# Altium project Comb_Generator.PrjPcb
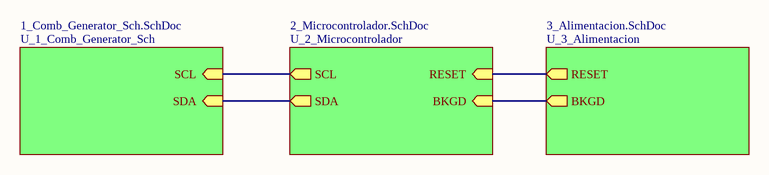
[diagram p0: Esquematico.SchDoc]
4 sheets, 62 parts. Net scope: hierarchical (ports join the sheet entries above them; power ports are global).
Board file: Comb_Generator_PCB.PcbDoc
Sheets:
  Esquematico.SchDoc
    U_1_Comb_Generator_Sch = 1_Comb_Generator_Sch.SchDoc
    U_2_Microcontrolador = 2_Microcontrolador.SchDoc
    U_3_Alimentacion = 3_Alimentacion.SchDoc

## Sheet Esquematico.SchDoc
size A4; SheetNumber: 1; SheetTotal: 4

### Sub-sheets
U_1_Comb_Generator_Sch = 1_Comb_Generator_Sch.SchDoc: SCL (in), SDA (in)
U_2_Microcontrolador = 2_Microcontrolador.SchDoc: RESET (in), BKGD (in), SCL (out), SDA (out)
U_3_Alimentacion = 3_Alimentacion.SchDoc: RESET (out), BKGD (out)

### Nets
BKGD: sheet U_2_Microcontrolador/BKGD, sheet U_3_Alimentacion/BKGD
RESET: sheet U_2_Microcontrolador/RESET, sheet U_3_Alimentacion/RESET
SCL: sheet U_1_Comb_Generator_Sch/SCL, sheet U_2_Microcontrolador/SCL
SDA: sheet U_1_Comb_Generator_Sch/SDA, sheet U_2_Microcontrolador/SDA

## Sheet 1_Comb_Generator_Sch.SchDoc
size A4; SheetNumber: 2; SheetTotal: 4; SPICEModelCacheYMJCRCOB: <root> / <DocumentId>YMJCRCOB</DocumentId> / </root>
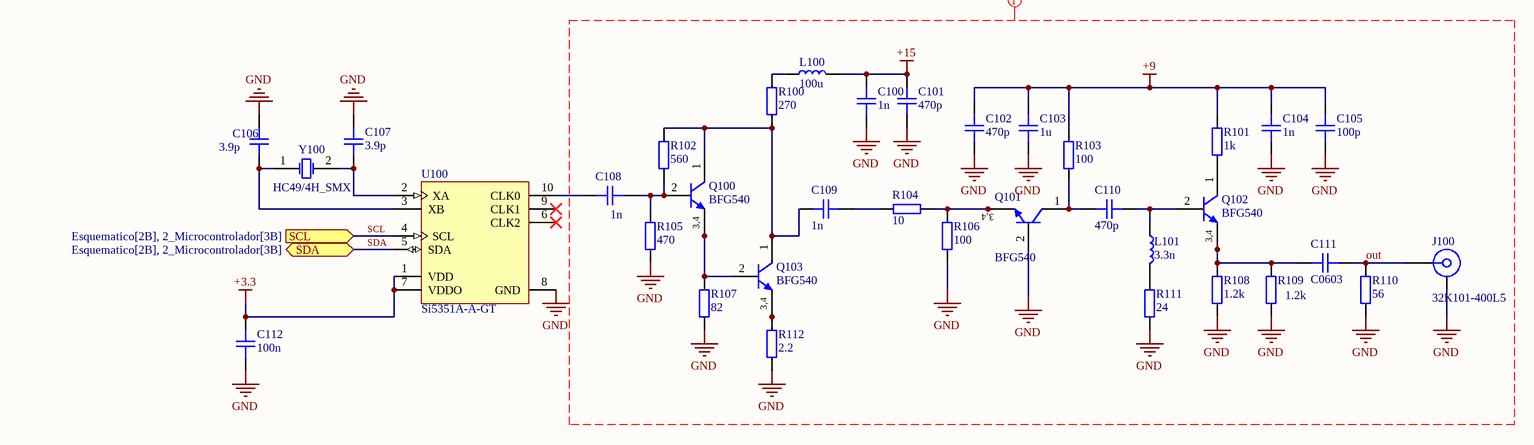
[diagram p1: 1_Comb_Generator_Sch.SchDoc]

### Parts
C100  1n  [CAP_0603]
C101  470p  [CAP_0603]
C102  470p  [CAP_0603]
C103  1u  [CAP_0603]
C104  1n  [CAP_0603]
C105  100p  [CAP_0603]
C106  3.9p  [CAP_0603]
C107  3.9p  [CAP_0603]
C108  1n  [CAP_0603]
C109  1n  [CAP_0603]
C110  470p  [CAP_0603]
C111  C0603  [CAP_0603]
C112  100n  [CAP_0603]
J100  32K101-400L5  [ROS-32K101-400L5_V]
L100  100u  [IND_0603]
L101  3.3n  [IND_0603]
Q100  BFG540  [SOT143B_N]
Q101  BFG540  [SOT143B_N]
Q102  BFG540  [SOT143B_N]
Q103  BFG540  [SOT143B_N]
R100  270  [RES_0603]
R101  1k  [RES_0603]
R102  560  [RES_0603]
R103  100  [RES_0603]
R104  10  [RES_0603]
R105  470  [RES_0603]
R106  100  [RES_0603]
R107  82  [RES_0603]
R108  1.2k  [RES_0603]
R109  1.2k  [RES_0603]
R110  56  [RES_0603]
R111  24  [RES_0603]
R112  2.2  [RES_0603]
U100  Si5351A-A-GT  [SLAB-MSOP-10_N]
Y100  HC49/4H_SMX  [HC49/4H_SMX]

### Ports
SCL (in, see Esquematico[2B], 2_Microcontrolador[3B]), SDA (bidir, see Esquematico[2B], 2_Microcontrolador[3B])

### Nets
+3.3: C112.1 U100.1(VDD) U100.7(VDDO)
+9: C102.1 C103.1 C104.1 C105.1 R101.2 R103.2
+15: C100.1 C101.1 L100.1
GND: C100.2 C101.2 C102.2 C103.2 C104.2 C105.2 C106.2 C107.2 C112.2 J100.MH Q101.2(B) R105.1 R106.1 R107.1 R108.1 R109.1 R110.1 R111.1 R112.1 U100.8(GND)
out: C111.2 J100.1 R110.2
SCL: U100.4(SCL) ; port SCL
SDA: U100.5(SDA) ; port SDA
NetC106_1: C106.1 U100.3(XB) Y100.1(OSC1)
NetC107_1: C107.1 U100.2(XA) Y100.2(OSC2)
NetC108_1: C108.1 Q100.2(B) R102.1 R105.2
NetC108_2: C108.2 U100.10(CLK0)
NetC109_1: C109.1 Q100.1(C) Q103.1(C) R100.1 R102.2
NetC109_2: C109.2 R104.2
NetC110_1: C110.1 L101.1 Q102.2(B)
NetC110_2: C110.2 Q101.1(C) R103.1
NetC111_1: C111.1 Q102.3(E) Q102.4(E) R108.2 R109.2
NetL100_2: L100.2 R100.2
NetL101_2: L101.2 R111.2
NetQ100_3: Q100.3(E) Q100.4(E) Q103.2(B) R107.2
NetQ101_3: Q101.3(E) Q101.4(E) R104.1 R106.2
NetQ102_1: Q102.1(C) R101.1
NetQ103_3: Q103.3(E) Q103.4(E) R112.2

Not connected (* = marked no-connect by the designer): U100 6(CLK2)* 9(CLK1)*

### Layout directives
net class RF_IMPEDANCE: +9, +15, GND, out

### Notes on the sheet
- (in symbol BFG540) 3,4

### Library data of the parts
C100-C112 = CAP_0603: Capacitor SMD 0603; Manufacturer: *; Manufacturer Part Number: *; Distributor Link: *; LCSC: *; Rating: *; Dielectric: *
J100 = CMP-0751-00001-1: SMA Straight Jack, Up to 18 GHz, -55 to 155 degC; Manufacturer: Rosenberger; Design Note: Footprint in library is a generic example - only application specific footprint delivers High Performance; PartNumber: 32K101-400L5; PackageDescription: SMA Straight Jack, 6.35 x 6.35 x 9.5 mm; ComponentLink5URL: http://www.rosenberger.com/en/contact/sales/; DatasheetVersion: a00; ComponentLink3URL: http://rosenberger.de/ok/images/documents/db/32K101-400L5.pdf; ComponentLink4Description: Series Overview / Design Note; ComponentLink5Description: Webshop / RFQ; PackageReference: 32K101-400L5; ComponentLink2Description: Datasheet; PackageVersion: a00; ComponentLink1Description: Manufacturer URL; ComponentLink3Description: Package Specification; ComponentLink2URL: http://rosenberger.de/ok/images/documents/db/32K101-400L5.pdf; Mounting Technology: Through Hole; ComponentLink1URL: http://www.rosenberger.de; ComponentLink4URL: http://rosenberger.de/ok/images/documents/spez/32.pdf
L100 L101 = IND_0603: Inductor SMD 0603
Q100-Q103 = BFG540: NPN 9 GHz Wideband Transistor; Published: 17-Sep-2003; LatestRevisionDate: 12-Dec-2006; LatestRevisionNote: IPC-7351 Footprint Added.; DatasheetVersion: 23-May-2000; PackageVersion: Oct-2001; PackageReference: SOT143B; Publisher: Altium Limited; PackageDescription: 4-Pin SOT-143 Package 1.9 mm Pitch, 2.3 mm Lead Span; ComponentLink1Description: Manufacturer Link; ComponentLink1URL: http://www.semiconductors.philips.com/; ComponentLink2Description: Datasheet; ComponentLink2URL: http://www.semiconductors.philips.com/acrobat/datasheets/BFG540_X_XR_4.pdf
R100-R112 = RES_0603: Resistor SMD 0603; Manufacturer: *; Manufacturer Part Number: *; Distributor Link: *; LCSC: *
U100 = Si5351A-A-GT: I2C-Programmable Any-Frequency CMOS Clock Generator + VCXO, 2.5 / 3.3 V, 0.008 to 160 MHz Output, -40 to 85 degC, 10-pin SOP; Manufacturer: Silicon Labs; Output Format: LVCMOS; Reference Inputs: 1; VDD: 2.5 V; 3.3 V; Sub-Family: Clock Generators; DatasheetVersion: Rev. 0.95; PackageReference: MSOP-10; PackageDescription: 10-Pin Mini Small Outline Package, Body 3 x 3 mm, Pitch 0.5 mm; Supplier 1: Digi-Key; Supplier Part Number 1: 336-1994-5-ND; Supplier 2: Mouser; Supplier Part Number 2: 634-SI5351A-A-GT; Output Frequency (MHz): 0.008 to 160; Mounting Technology: Surface Mount; Code_JEDEC: MO-187; Code_IPC: J-STD-020; PartNumber: Si5351A-A-GT; ComponentLink1Description: Manufacturer URL; ComponentLink1URL: http://www.silabs.com/; ComponentLink2Description: Datasheet; ComponentLink2URL: http://www.silabs.com/Support%20Documents/TechnicalDocs/Si5351.pdf; ComponentLink3Description: Package Specification; ComponentLink3URL: http://www.silabs.com/Support Documents/TechnicalDocs/C8051T60x.pdf
Y100 = HC49/4H_SMX: Surface Mount Quartz Crystal; Note: PCB layout complies with manufacturer's recommendation.; Published: 17-Jul-2002; DatasheetDocument: 18-Oct-1999; PackageDocument: 18-Oct-1999; PackageReference: HC49/4H_SMX; Publisher: Altium Limited; ComponentLink1Description: Manufacturer Link; ComponentLink1URL: http://www.cmac.com/mt/; ComponentLink2Description: Datasheet; ComponentLink2URL: http://www.cmac.com/mt/databook/crystals/smd/hc49_4h_smx.pdf

## Sheet 2_Microcontrolador.SchDoc
size A4; SheetNumber: 3; SheetTotal: 4; SPICEModelCacheOGEEZERP: <root> / <DocumentId>OGEEZERP</DocumentId> / </root>
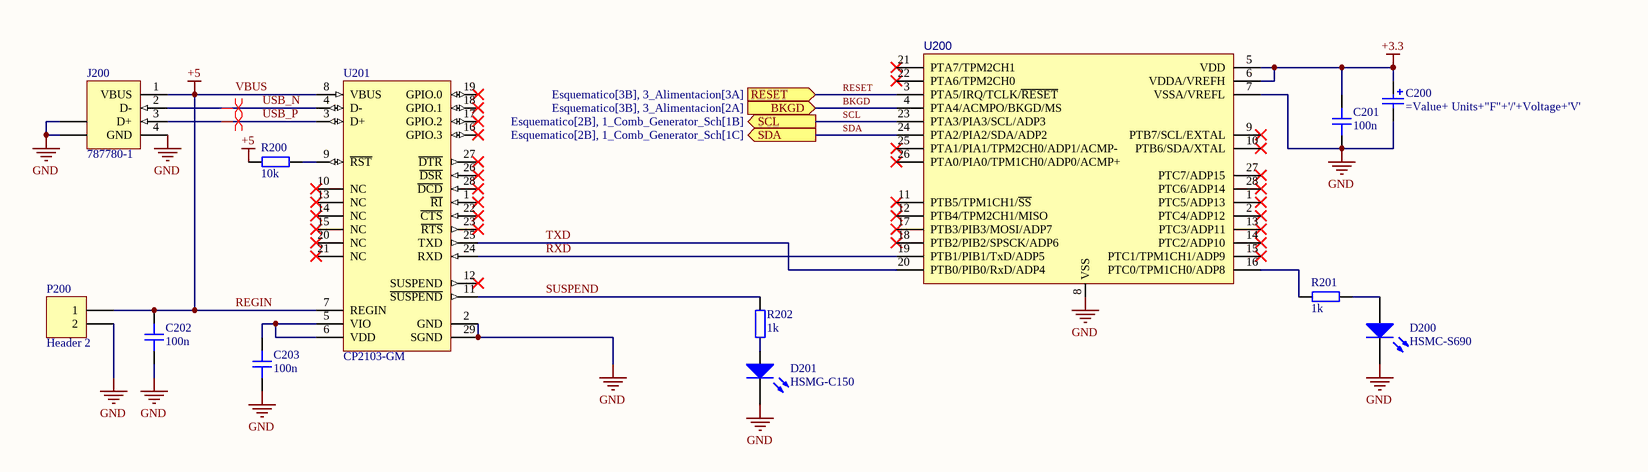
[diagram p2: 2_Microcontrolador.SchDoc]

### Parts
C200  (no value)  [C SIZE SMD CAPACITOR]
C201  100n  [CAP_0603]
C202  100n  [CAP_0603]
C203  100n  [CAP_0603]
D200  HSMC-S690  [1.6X0.8X0.7]
D201  HSMG-C150  [3.2X1.6X1.1]
J200  787780-1  [USB 787780]
P200  Header 2  [HDR1X2]
R200  10k  [RES_0603]
R201  1k  [RES_0603]
R202  1k  [RES_0603]
U200  (no value)  [TSSOP28_25.5_295_15X58_SMD]
U201  CP2103-GM  [SLAB-QFN-28-3125x3125TP_A_N]

### Ports
BKGD (in, see Esquematico[3B], 3_Alimentacion[2A]), RESET (in, see Esquematico[3B], 3_Alimentacion[3A]), SCL (out, see Esquematico[2B], 1_Comb_Generator_Sch[1B]), SDA (out, see Esquematico[2B], 1_Comb_Generator_Sch[1C])

### Nets
+3.3: C200.1 C201.1 U200.5(VDD) U200.6(VDDA/VREFH)
GND: C200.2 C201.2 C202.2 C203.2 D200.2(K) D201.2(K) J200.4(GND) J200.5(SHLD) J200.6(SHLD) P200.2 U200.7(VSSA/VREFL) U200.8(VSS) U201.2(GND) U201.29(SGND)
REGIN: C202.1 J200.1(VBUS) P200.1 R200.2 U201.7(REGIN) U201.8(VBUS)  [also labelled +5, VBUS]
BKGD: U200.4(PTA4/ACMPO/BKGD/MS) ; port BKGD
RESET: U200.3(PTA5/IRQ/TCLK/~{RESET}) ; port RESET
RXD: U200.19(PTB1/PIB1/TxD/ADP5) U201.24(RXD)
SCL: U200.23(PTA3/PIA3/SCL/ADP3) ; port SCL
SDA: U200.24(PTA2/PIA2/SDA/ADP2) ; port SDA
SUSPEND: R202.1 U201.11(~{SUSPEND})
TXD: U200.20(PTB0/PIB0/RxD/ADP4) U201.25(TXD)
USB_N: J200.2(D-) U201.4(D-)
USB_P: J200.3(D+) U201.3(D+)
NetC203_1: C203.1 U201.5(VIO) U201.6(VDD)
NetD200_1: D200.1(A) R201.2
NetD201_1: D201.1(A) R202.2
NetR200_1: R200.1 U201.9(~{RST})
NetR201_1: R201.1 U200.16(PTC0/TPM1CH0/ADP8)

Not connected (* = marked no-connect by the designer): U200 1(PTC5/ADP13)* 2(PTC4/ADP12)* 9(PTB7/SCL/EXTAL)* 10(PTB6/SDA/XTAL)* 11(PTB5/TPM1CH1/~{SS})* 12(PTB4/TPM2CH1/MISO)* 13(PTC3/ADP11)* 14(PTC2/ADP10)* 15(PTC1/TPM1CH1/ADP9)* 17(PTB3/PIB3/MOSI/ADP7)* 18(PTB2/PIB2/SPSCK/ADP6)* 21(PTA7/TPM2CH1)* 22(PTA6/TPM2CH0)* 25(PTA1/PIA1/TPM2CH0/ADP1/ACMP-)* 26(PTA0/PIA0/TPM1CH0/ADP0/ACMP+)* 27(PTC7/ADP15)* 28(PTC6/ADP14)*; U201 1(~{RI})* 10(NC)* 12(SUSPEND)* 13(NC)* 14(NC)* 15(NC)* 16(GPIO.3)* 17(GPIO.2)* 18(GPIO.1)* 19(GPIO.0)* 20(NC)* 21(NC)* 22(~{CTS})* 23(~{RTS})* 26(~{DSR})* 27(~{DTR})* 28(~{DCD})*

### Layout directives
differential pair; differential pair class USB: USB_N, USB_P

### Library data of the parts
C200 = Cap Pol1: Capacitor Electr. Alum. SMD WxLxH 6.3x6.3x5.3 Ǿ= 6 mm; Manufacturer: Generic Components; Class: Passive; Value: 47; PDT: PDT_GA500P+; CRITICO: NO; Voltage: 16; Diam: 6.3; Units: u; ASY_DESCRIPTION: Electrónica Galert 500P+; ASY_CRITICO: S; ELEMON: EH51EM470E05OC; Published: 08/06/2000; Publisher: Altium Hobart Technology Centre; SubClass: Capacitor; GAMMASYS: =C+auto_range + ''+Exponent+Material+Voltage+ PackageReference; ASY: =PS+PCB+'R'+PCB_REV; PackageReference: 0607; Height: 10; auto_range: =(NORM >= 1) * (NORM < 100) * NORM + (NORM >= 1E2) * (NORM < 1E3) * NORM / 10 + (NORM >= 1E3) * (NORM < 1E4) * NORM / 1E2 + (NORM >= 1E4) * (NORM < 1E5) * NORM / 1E3 + (NORM >= 1E5) * (NORM < 1E6) * NORM / 1E4 + (NORM >= 1E6) * (NORM < 1E7) * NORM / 1E5 + (NORM >= 1E7) * (NORM < 1E8) * NORM / 1E6 + (NORM >= 1E8) * (NORM < 1E9) * NORM / 1E7 + (NORM >= 1E9) * (NORM < 1E10) * NORM / 1E8 + (NORM >= 1E10) * (NORM < 1E11) * NORM / 1E9; Exponent: =(NORM >= 1) * (NORM < 1E2) * 0 || (NORM >= 1E2) * (NORM < 1E3) * 1 || (NORM >= 1e3) * (NORM < 1e4) * 2 ||(NORM >= 1E4) * (NORM < 1E5) * 3 || (NORM >= 1E5) * (NORM < 1E6) * 4 || (NORM >= 1E6) * (NORM < 1E7) * 5 || (NORM >= 1E7) * (NORM < 1E8) * 6 || (NORM >= 1E8) * (NORM < 1E9) * 7 || (NORM >= 1E9) * (NORM < 1E10) * 8 || (NORM >= 1E10) * (NORM < 1E11) * 9; NORM: =-(not (Units <> m) * 1E3 + not (Units <> u)*1E0 )*Value
C201-C203 = CAP_0603: Capacitor SMD 0603; Manufacturer: *; Manufacturer Part Number: *; Distributor Link: *; LCSC: *; Rating: *; Dielectric: *
D200 = HSMC-S690: SMT Top Mount Chip LED, Red; LuminousIntensity: 16mcd (Minimum).; PCB_Layout: Complies with manufacturer's recommendation.; Published: 11-Dec-2002; DatasheetDocument: 29-Oct-2001; PackageDocument: 29-Oct-2001; PackageReference: 1.6X0.8X0.7; Publisher: Altium Limited; LED_Colour: Red; ComponentLink1Description: Manufacturer Link; ComponentLink1URL: http://www.agilent.com/; ComponentLink2Description: Datasheet; ComponentLink2URL: http://cp.literature.agilent.com/litweb/pdf/5988-4445EN.pdf
D201 = HSMG-C150: Surface Mount Chip LED, Green; LuminousIntensity: 4mcd (Minimum).; PCB_Layout: Complies with manufacturer's recommendation.; Published: 11-Dec-2002; DatasheetDocument: 30-Apr-2002; PackageDocument: 26-Feb-2002; PackageReference: 3.2X1.6X1.1; Publisher: Altium Limited; LED_Colour: Green; ComponentLink1Description: Manufacturer Link; ComponentLink1URL: http://www.agilent.com/; ComponentLink2Description: Datasheet; ComponentLink2URL: http://cp.literature.agilent.com/litweb/pdf/5988-6271EN.pdf
J200 = 787780-1: USB 1.1, Right Angle, Thru-Hole, B Type, Receptacle, 4 Position, Black; ContactMaterial: Copper Alloy; ContactPlating: Gold Flash over Palladium Nickel or Gold (30) over Nickel; TerminationLength: 3.00mm [0.118in.]; PCB_Layout: Complies with manufacturer's recommendation.; DrillSize: Corresponds to nominal value.; PanelGround: Without; Published: 15-Jul-2004; DatasheetDocument: 11-Jan-2004; PackageDocument: 11-Jan-2004; PackageReference: 787780; Publisher: Altium Limited; HousingMaterial: Thermoplastic; ComponentLink1Description: Manufacturer Link; ComponentLink1URL: http://www.tycoelectronics.com/; ComponentLink2Description: Packaging Specification; ComponentLink2URL: http://ecommas.tycoelectronics.com/commerce/DocumentDelivery/DDEController?Action=showdoc&DocId=Customer+Drawing%7F787780%7FF%7Ftif%7FEnglish%7FENG_CD_787780_F.tif
P200 = Header 2: Header, 2-Pin; LatestRevisionDate: 17-Jul-2002; LatestRevisionNote: Re-released for DXP Platform.; Publisher: Altium Limited
R200-R202 = RES_0603: Resistor SMD 0603; Manufacturer: *; Manufacturer Part Number: *; Distributor Link: *; LCSC: *
U200 = MC9S08SH32CTL: IC MCU 8BIT 32KB FLASH 28TSSOP / WITH AUTO-DIRECTION SENSING AND ±15-kV ESD PROTECTION; Part Number: MC9S08SH32CTL_TSSOP28; Manufacturer: NXP USA Inc.; Publico: AP; Value: MC9S08SH32; Manufacturer Part Number: MC9S08SH32CTL; Supplier 1: Digi-Key; Supplier Part Number 1: MC9S08SH32CTL-ND; Aprobo: -
U201 = CP2103-GM: Single-Chip USB to UART Bridge, 1024 Bytes EEPROM, -40 to 85 degC, 28-pin QFN, Tube; Manufacturer: Silicon Labs; Internal Oscillator: TRUE; Sub-Family: USB Bridges; DatasheetVersion: Rev. 1.0; PackageReference: QFN-28; PackageDescription: 28-Pin Quad-Flat No-Leads Package, Body 5 x 5 mm, Pitch 0.5 mm; Supplier 1: Digi-Key; Supplier Part Number 1: 336-1164-ND; Supplier 2: Farnell; Supplier Part Number 2: 1291538; Supplier 3: Newark; Supplier Part Number 3: 24M1109; Supplier 4: Mouser; Supplier Part Number 4: 634-CP2103-GM; EEPROM: 1024 Bytes; Mounting Technology: Surface Mount; PartNumber: CP2103-GM; ComponentLink1Description: Manufacturer URL; ComponentLink1URL: http://www.silabs.com/; ComponentLink2Description: Datasheet; ComponentLink2URL: http://www.silabs.com/Support%20Documents/TechnicalDocs/CP2103.pdf; ComponentLink3Description: Package Specification; ComponentLink3URL: http://www.silabs.com/Support%20Documents/TechnicalDocs/C8051F35x.pdf

## Sheet 3_Alimentacion.SchDoc
size A4; SheetNumber: 4; SheetTotal: 4
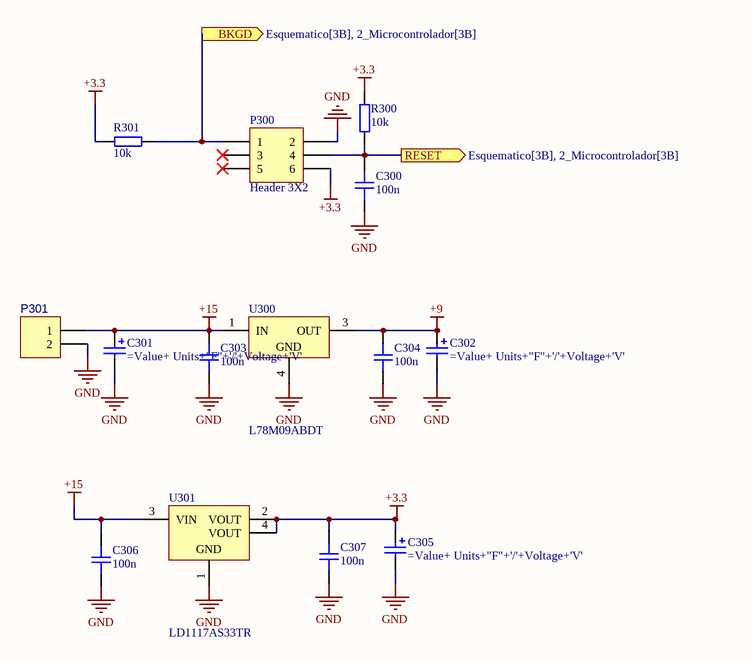
[diagram p3: 3_Alimentacion.SchDoc]

### Parts
C300  100n  [CAP_0603]
C301  (no value)  [C SIZE SMD CAPACITOR]
C302  (no value)  [C SIZE SMD CAPACITOR]
C303  100n  [CAP_0603]
C304  100n  [CAP_0603]
C305  (no value)  [C SIZE SMD CAPACITOR]
C306  100n  [CAP_0603]
C307  100n  [CAP_0603]
P300  Header 3X2  [HDR2X3]
P301  Conector Molex 2 vias Macho  [MOLEX INDENT 2 LOW PRF]  (value not drawn)
R300  10k  [RES_0603]
R301  10k  [RES_0603]
U300  L78M09ABDT  [TO-252]
U301  LD1117AS33TR  [SOT-223_N]

### Ports
BKGD (out, see Esquematico[3B], 2_Microcontrolador[3B]), RESET (out, see Esquematico[3B], 2_Microcontrolador[3B])

### Nets
+3.3: C305.1 C307.1 P300.6 R300.1 R301.2 U301.2(VOUT) U301.4(VOUT)
+9: C302.1 C304.1 U300.3(OUT)
+15: C301.1 C303.1 C306.1 P301.1 U300.1(IN) U301.3(VIN)
GND: C300.2 C301.2 C302.2 C303.2 C304.2 C305.2 C306.2 C307.2 P300.2 P301.2 U300.4(GND) U301.1(GND)
BKGD: P300.1 R301.1 ; port BKGD
RESET: C300.1 P300.4 R300.2 ; port RESET

Not connected (* = marked no-connect by the designer): P300 3* 5*

### Library data of the parts
C300 C303 C304 C306 C307 = CAP_0603: Capacitor SMD 0603; Manufacturer: *; Manufacturer Part Number: *; Distributor Link: *; LCSC: *; Rating: *; Dielectric: *
C301 C302 C305 = Cap Pol1: as C200 on sheet 2_Microcontrolador; Published: 08/06/2000; Publisher: Altium Hobart Technology Centre; SubClass: Capacitor; GAMMASYS: =C+auto_range + ''+Exponent+Material+Voltage+ PackageReference; ASY: =PS+PCB+'R'+PCB_REV; PackageReference: 0607; Height: 10; auto_range: =(NORM >= 1) * (NORM < 100) * NORM + (NORM >= 1E2) * (NORM < 1E3) * NORM / 10 + (NORM >= 1E3) * (NORM < 1E4) * NORM / 1E2 + (NORM >= 1E4) * (NORM < 1E5) * NORM / 1E3 + (NORM >= 1E5) * (NORM < 1E6) * NORM / 1E4 + (NORM >= 1E6) * (NORM < 1E7) * NORM / 1E5 + (NORM >= 1E7) * (NORM < 1E8) * NORM / 1E6 + (NORM >= 1E8) * (NORM < 1E9) * NORM / 1E7 + (NORM >= 1E9) * (NORM < 1E10) * NORM / 1E8 + (NORM >= 1E10) * (NORM < 1E11) * NORM / 1E9; Exponent: =(NORM >= 1) * (NORM < 1E2) * 0 || (NORM >= 1E2) * (NORM < 1E3) * 1 || (NORM >= 1e3) * (NORM < 1e4) * 2 ||(NORM >= 1E4) * (NORM < 1E5) * 3 || (NORM >= 1E5) * (NORM < 1E6) * 4 || (NORM >= 1E6) * (NORM < 1E7) * 5 || (NORM >= 1E7) * (NORM < 1E8) * 6 || (NORM >= 1E8) * (NORM < 1E9) * 7 || (NORM >= 1E9) * (NORM < 1E10) * 8 || (NORM >= 1E10) * (NORM < 1E11) * 9; NORM: =-(not (Units <> m) * 1E3 + not (Units <> u)*1E0 )*Value
P300 = Header 3X2: Header, 3-Pin, Dual row; LatestRevisionDate: 17-Jul-2002; LatestRevisionNote: Re-released for DXP Platform.; Publisher: Altium Limited
P301 = Header 2: Header, 2-Pin; PDT: PDT_GA500P+; CRITICO: NO; ASY_DESCRIPTION: Electrónica Galert 500P+; ASY_CRITICO: S; SYC: 2317SJ-02; LatestRevisionDate: 17-Jul-2002; LatestRevisionNote: Re-released for DXP Platform.; Publisher: Altium Limited; GAMMASYS: ='P2317SJ-02'; ASY: =PS+PCB+'R'+PCB_REV
R300 R301 = RES_0603: Resistor SMD 0603; Manufacturer: *; Manufacturer Part Number: *; Distributor Link: *; LCSC: *
U300 = L78M09ABDT: Precision 500mA Regulator; Published: 24-Aug-2001; LatestRevisionDate: 06-Jun-2005; LatestRevisionNote: PCB pads lengthened.; DatasheetVersion: Mar-1997; PackageVersion: Jun-2004; PackageReference: TO-252; Publisher: Altium Limited; PackageDescription: D-PAK/TO-252-AA; 3 Leads (1 Cropped); Body 10.1 (inc. leads) x 6.6 mm (LxW max); ComponentLink1Description: Manufacturer Link; ComponentLink1URL: http://www.st.com/; ComponentLink2Description: Datasheet; ComponentLink2URL: http://www.st.com/stonline/products/literature/ds/2147/l78m05ab.pdf
U301 = LD1117AS33TR: 1A, Low Drop Positive Voltage Regulator, 3.3V, 4-Pin SOT-223, Tape and Reel; DatasheetVersion: Dec-2011; PackageVersion: 2010; PackageReference: SOT-223; PackageDescription: 4-Pin SOT-223 Package, 6.5 x 3.5 mm Body, 2.3 mm Pitch, 7 mm Lead Span; PartNumber: LD1117AS33TR; ComponentLink1Description: Manufacturer URL; ComponentLink1URL: http://www.st.com; ComponentLink2Description: Datasheet; ComponentLink2URL: http://www.st.com/internet/com/TECHNICAL_RESOURCES/TECHNICAL_LITERATURE/DATASHEET/CD00002116.pdf

## Nets that join several sheets
+3.3: 1_Comb_Generator_Sch (C112.1 U100.1 U100.7), 2_Microcontrolador (C200.1 C201.1 U200.5 U200.6), 3_Alimentacion (7 pins)
+9: 1_Comb_Generator_Sch (6 pins), 3_Alimentacion (C302.1 C304.1 U300.3)
+15: 1_Comb_Generator_Sch (C100.1 C101.1 L100.1), 3_Alimentacion (6 pins)
GND: 1_Comb_Generator_Sch (20 pins), 2_Microcontrolador (14 pins), 3_Alimentacion (12 pins)
BKGD: 2_Microcontrolador (U200.4), 3_Alimentacion (P300.1 R301.1)
RESET: 2_Microcontrolador (U200.3), 3_Alimentacion (C300.1 P300.4 R300.2)
SCL: 1_Comb_Generator_Sch (U100.4), 2_Microcontrolador (U200.23)
SDA: 1_Comb_Generator_Sch (U100.5), 2_Microcontrolador (U200.24)